# EAGLE design EncoderTBPCB (EAGLE 7.7.0)
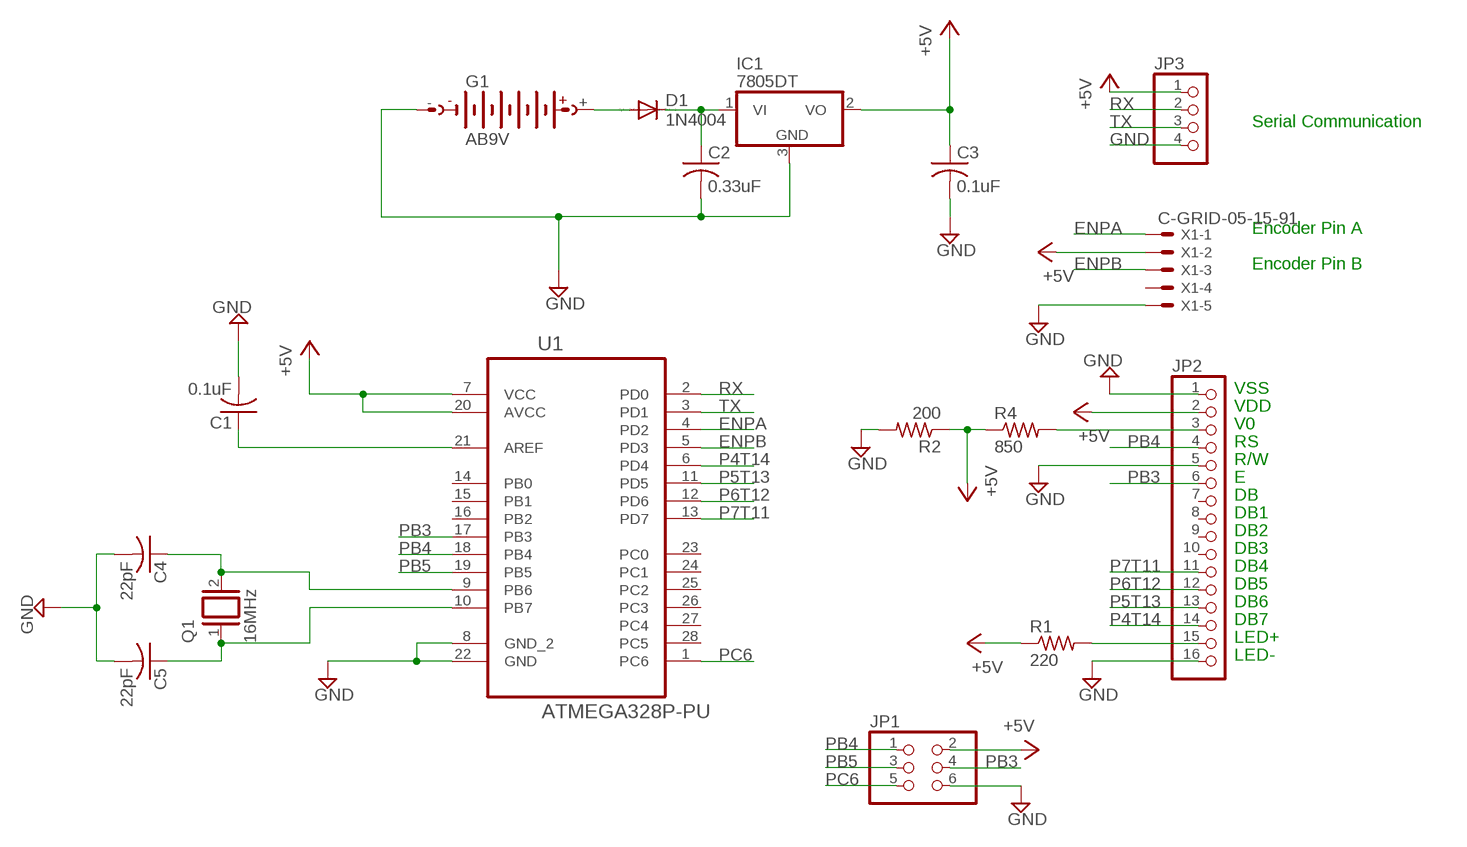
[diagram p0: schematic, sheet 1]

## Parts
C1  0.1uF  C-USC0603  [C0603]
C2  0.33uF  C-USC0603  [C0603]
C3  0.1uF  C-USC0603  [C0603]
C4  22pF  C-USC0603  [C0603]
C5  22pF  C-USC0603  [C0603]
D1  1N4004  [DO41-10]
G1  AB9V  [AB9V]
IC1  7805DT  [TO252]
JP1  PINHD-2X3  [2X03]
JP2  PINHD-1X16  [1X16]
JP3  PINHD-1X4  [1X04]
Q1  16MHz  XTAL/S  [QS]
R1  220  R-US_R0603  [R0603]
R2  200  R-US_R0603  [R0603]
R4  850  R-US_R0603  [R0603]
U1  ATMEGA328P-PU  [DIP254P762X457-28]
X1  C-GRID-05-15-91  [15-91-05]

## Nets
CRYSTAL: C4.1 Q1.2 U1.9(PB6)
ENPA: U1.4(PD2) X1.1
ENPB: U1.5(PD3) X1.3
GND: C1.2 C2.2 C3.2 C4.2 C5.2 G1.- IC1.3(GND) JP1.6 JP2.1 JP2.5 JP2.16 JP3.4 R2.2 U1.8(GND_2) U1.22(GND) X1.5
N$2: JP2.15 R1.2
N$11: C5.1 Q1.1 U1.10(PB7)
N$12: C1.1 U1.21(AREF)
N$15: D1.A G1.+
N$16: C2.1 D1.C IC1.1(VI)
P4T14: JP2.14 U1.6(PD4)
P5T13: JP2.13 U1.11(PD5)
P6T12: JP2.12 U1.12(PD6)
P7T11: JP2.11 U1.13(PD7)
PB3: JP1.4 JP2.6 U1.17(PB3)
PB4: JP1.1 JP2.4 U1.18(PB4)
PB5: JP1.3 U1.19(PB5)
PC6: JP1.5 U1.1(PC6)
RX: JP3.2 U1.2(PD0)
TX: JP3.3 U1.3(PD1)
VDD: C3.1 IC1.2(VO) JP1.2 JP2.2 JP3.1 R1.1 R2.1 R4.1 U1.7(VCC) U1.20(AVCC) X1.2 ; supply symbol labelled +5V
VO: JP2.3 R4.2
Unconnected: JP2.7 JP2.8 JP2.9 JP2.10 U1.14(PB0) U1.15(PB1) U1.16(PB2) U1.23(PC0) U1.24(PC1) U1.25(PC2) U1.26(PC3) U1.27(PC4) U1.28(PC5) X1.4

## Notes on the sheet
- Serial Communication
- Encoder Pin A
- Encoder Pin B
- VSS
- VDD
- V0
- RS
- R/W
- E
- DB
- DB1
- DB2
- DB3
- DB4
- DB5
- DB6
- DB7
- LED+
- LED-

## Library data of the parts
C1-C5 = resistor:C-US: CAPACITOR, American symbol
D1 = diode:1N4004: DIODE general purpose rectifier, 1 A
G1 = battery:AB9V: 9-V BATTERY CLIP
IC1 = linear:78*: Positive VOLTAGE REGULATOR Source: http://cache.national.com/ds/LM/LM78L05.pdf http://www.fairchildsemi.com/ds/LM/LM7805.pdf
JP1 = pinhead:PINHD-2X3: PIN HEADER
JP2 = pinhead:PINHD-1X16: PIN HEADER
JP3 = pinhead:PINHD-1X4: PIN HEADER
Q1 = special:XTAL/S: CRYSTAL
R1 R2 R4 = resistor:R-US_: RESISTOR, American symbol
U1 = Atmel_By_element14_Batch_1-00:ATMEGA328P-PU: 8-bit Microcontroller with In-System Programmable Flash; MPN: ATMEGA328P-PU; OC_FARNELL: 1715487; OC_NEWARK: 15R0268; PACKAGE: PDIP-28; SUPPLIER: Atmel
X1 = con-molex:C-GRID-05: CONNECTOR wire to board 2.54 mm (0.100") pitch header

## Board
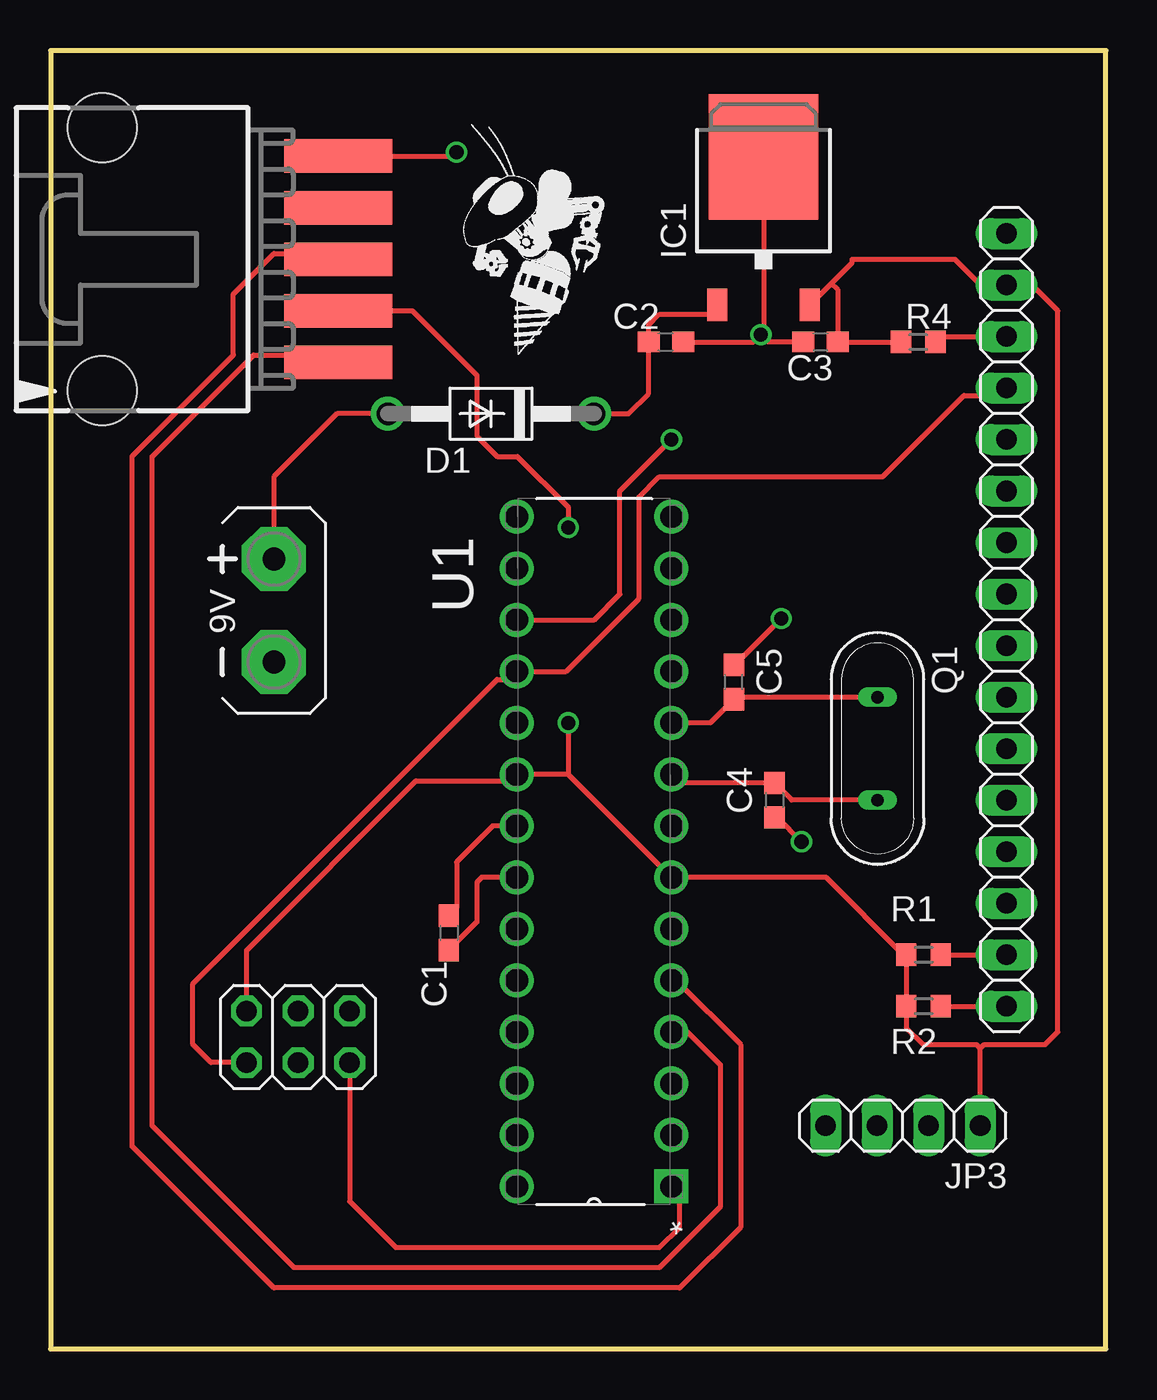
[diagram p1: board, top side]
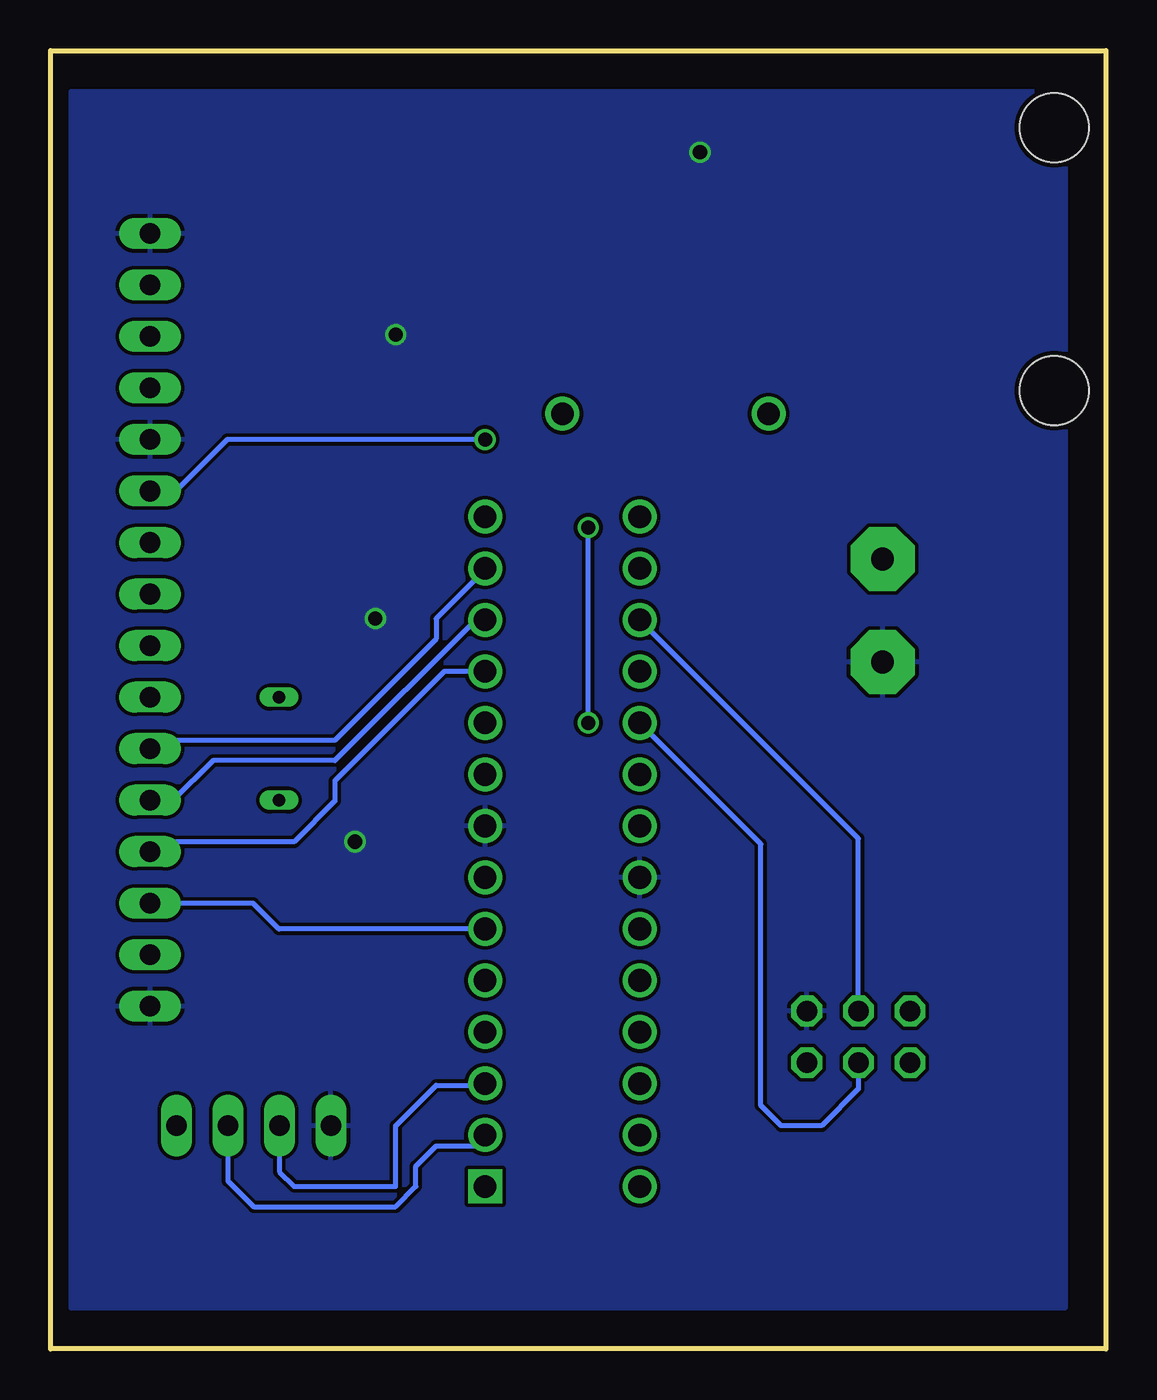
[diagram p2: board, bottom side, seen from below]

Size 52 x 64 mm. Coordinates in mm from the lower left corner, seen from the top.
Outline: 52,64 0,64 0,0 52,0 52,64
Copper layers (1*16): Top 0.018mm / dielectric 1.55mm / Bottom 0.018mm
Design rules "eC_2Layer_PClass6_BaseCopperO18_eCDefault *": minimum track width 0.15mm, minimum drill 0.35mm, track to track 0.18mm, track to pad 0.18mm, pad to pad 0.18mm, via to via 0.18mm, smd to smd 0mil, copper to edge 0.25mm, drill to drill 0.35mm, minimum pad ring 0.175mm, minimum via ring 0.125mm, stop-mask expansion 0mil, vias tented up to drill 0.45mm, thermal gap 0.2mm

### Footprints (pad centres in the part's own frame; a part is rotated, then mirrored left to right if it is on the bottom)
C0603 = smd 1.1 x 1: 1 -0.85,0; 2 0.85,0
DO41-10 = drill 1.118: A 5.08,0; C -5.08,0
AB9V = drill 1.118 pad 3.15 octagon: + 0,2.54; - 0,-2.54
TO252 = smd 1 x 1.6: 1 -2.28,-4.8; 2 2.28,-4.8 | smd 5.4 x 6.2: 3 0,2.5
2X03 = drill 1.016 octagon: 1 -2.54,-1.27; 2 -2.54,1.27; 3 0,-1.27; 4 0,1.27; 5 2.54,-1.27; 6 2.54,1.27
1X16 = drill 1.016 long: 1 -19.05,0; 2 -16.51,0; 3 -13.97,0; 4 -11.43,0; 5 -8.89,0; 6 -6.35,0; 7 -3.81,0; 8 -1.27,0; 9 1.27,0; 10 3.81,0; 11 6.35,0; 12 8.89,0; 13 11.43,0; 14 13.97,0; 15 16.51,0; 16 19.05,0
1X04 = drill 1.016 long: 1 -3.81,0; 2 -1.27,0; 3 1.27,0; 4 3.81,0
QS = drill 0.61 long: 1 -2.54,0; 2 2.54,0
R0603 = smd 1 x 1.1: 1 -0.85,0; 2 0.85,0
DIP254P762X457-28 = drill 1.118 square: 1 -7.62,33.02 | drill 1.118: 2 -7.62,30.48; 3 -7.62,27.94; 4 -7.62,25.4; 5 -7.62,22.86; 6 -7.62,20.32; 7 -7.62,17.78; 8 -7.62,15.24; 9 -7.62,12.7; 10 -7.62,10.16; 11 -7.62,7.62; 12 -7.62,5.08; 13 -7.62,2.54; 14 -7.62,0; 15 0,0; 16 0,2.54; 17 0,5.08; 18 0,7.62; 19 0,10.16; 20 0,12.7; 21 0,15.24; 22 0,17.78; 23 0,20.32; 24 0,22.86; 25 0,25.4; 26 0,27.94; 27 0,30.48; 28 0,33.02
15-91-05 = smd 1.651 x 5.334: 1 -5.08,-10.795; 2 -2.54,-10.795; 3 0,-10.795; 4 2.54,-10.795; 5 5.08,-10.795 | hole 3.404: -6.477,0.838; 6.477,0.838

### Placement (x,y rotation side)
C1  19.62,20.51 270 top
C2  30.32,49.64 0 top
C3  37.94,49.64 180 top
C4  35.67,27.05 270 top
C5  33.67,32.87 90 top
D1  21.7,46.1 180 top
G1  11,36.4 0 top
IC1  35.13,56.26 0 top
JP1  12.19,15.38 0 top
JP2  47.1,35.94 270 top
JP3  42,11 180 top
Q1  40.75,29.59 270 top
R1  43.02,19.43 0 top
R2  43.02,16.89 0 top
R4  42.75,49.64 0 top
U1  22.97,41.02 180 top
U$1  [ROBOBUZZ_0.6X]  23,49 0 top
X1  3.38,53.72 90 top

### Tracks (layer width: path | path; a pad name or v marks a point on that pad's centre or on a via)
CRYSTAL
  Top 0.254: U1.9 31.01,27.9 C4.1 36.52,27.05 Q1.2
ENPA
  Top 0.152: X1.1 12.18,48.64 12,48.47
  Top 0.254: U1.4 31.38,15.62 33,14 33,7 30,4 12,4 5,11 5,44 10,49 13.81,49 X1.1 14.64,48.64 15,49 | 12,48.47 12,48
ENPB
  Top 0.254: U1.5 30.84,18.16 34,15 34,6 31,3 11,3 4,10 4,44 9,49 9,52 11,54 12.85,54 12.98,53.87 | 11.89,54 12.98,53.87 | 12.98,53.87 X1.3
GND  (via drill 0.7)
  Top 0.254: 35.67,25.78 C4.2 35.8,26.2 v37,25 | 35,59.63 IC1.3 35.13,50.13 v35,50 | C5.2 33.72,33.72 v36,36 | C2.2 34.64,49.64 v35,50 | C3.2 35.36,49.64 v35,50 | U1.22 21.24,23.24 21,23 21,21.04 C1.2 | X1.5 20,58.8 v20,59 | R2.2 JP2.16
  pour Bottom: 2,62 2,2 51,2 51,62
N$2
  Top 0.254: R1.2 JP2.15
N$11
  Top 0.254: U1.10 32.51,30.86 C5.1 33.78,32.13 Q1.1
N$12
  Top 0.254: U1.21 21.78,25.78 20,24 20,21.74 C1.1
N$15
  Top 0.254: D1.A 14.1,46.1 11,43 G1.+ 11,38
N$16
  Top 0.254: D1.C 28.47,46.1 29.47,47.1 C2.1 29.47,50.47 30,51 32.39,51 IC1.1
P4T14
  Bottom 0.254: U1.6 40.75,20.7 42.02,21.97 JP2.14
P5T13
  Bottom 0.254: U1.11 32.6,33.4 38,28 38,27 40,25 46.61,25 JP2.13
P6T12
  Bottom 0.254: U1.12 31.06,35.94 38,29 44,29 46,27 47.05,27 JP2.12
P7T11
  Bottom 0.254: U1.13 30.59,38.41 33,36 33,35 38,30 46.69,30 JP2.11
PB3  (via drill 0.7)
  Top 0.254: U1.17 26.78,35.94 28.05,37.21 28.05,42.29 v30.59,44.83
  Bottom 0.254: v30.59,44.83 43.29,44.83 45.83,42.29 JP2.6 | JP1.4 12.19,25.16 U1.17
PB4
  Top 0.254: JP1.1 7.89,14.11 7,15 7,18 22,33 22.57,33 U1.18 25.4,33.4 29,37 29,42 30,43 41,43 45,47 46.73,47 JP2.4
PB5
  Bottom 0.254: JP1.3 12.19,12.81 14,11 16,11 17,12 17,24.89 U1.19
PC6
  Top 0.254: JP1.5 14.73,7.27 17,5 30,5 31,6 31,7.59 U1.1
RX
  Bottom 0.254: JP3.2 43.27,8.27 42,7 35,7 34,8 34,9 33,10 31.13,10 U1.2
TX
  Bottom 0.254: JP3.3 40.73,8.73 40,8 35,8 35,11 33,13 30.67,13 U1.3
VDD  (via drill 0.7)
  Top 0.254: v25.51,30.86 25.51,28.32 | 25.51,28.32 U1.20 22.65,28 18,28 9.65,19.65 JP1.2 | 25.51,28.32 U1.7 38.21,23.24 42.02,19.43 R1.1 R2.1 42.17,15.83 43,15 45.62,15 45.81,14.81 | R4.1 C3.1 38.79,52.21 38.48,52.52 | 38.48,52.52 39.48,53.53 39.48,53.72 44.56,53.72 45.83,52.45 JP2.2 48.37,52.45 49.64,51.18 49.64,15.62 49.02,15 46,15 45.81,14.81 | 38.48,52.52 IC1.2 | JP3.1 45.81,14.81 | X1.2 17.82,51.18 21,48 21,45 22,44 23,44 25.51,41.49 v25.51,40.49
  Bottom 0.254: v25.51,30.86 v25.51,40.49
VO
  Top 0.254: R4.2 43.87,49.91 JP2.3